# Altium schematic sheet DFSDM.SchDoc
size A4; DocumentNumber: 13; SheetNumber: 13; SheetTotal: 15
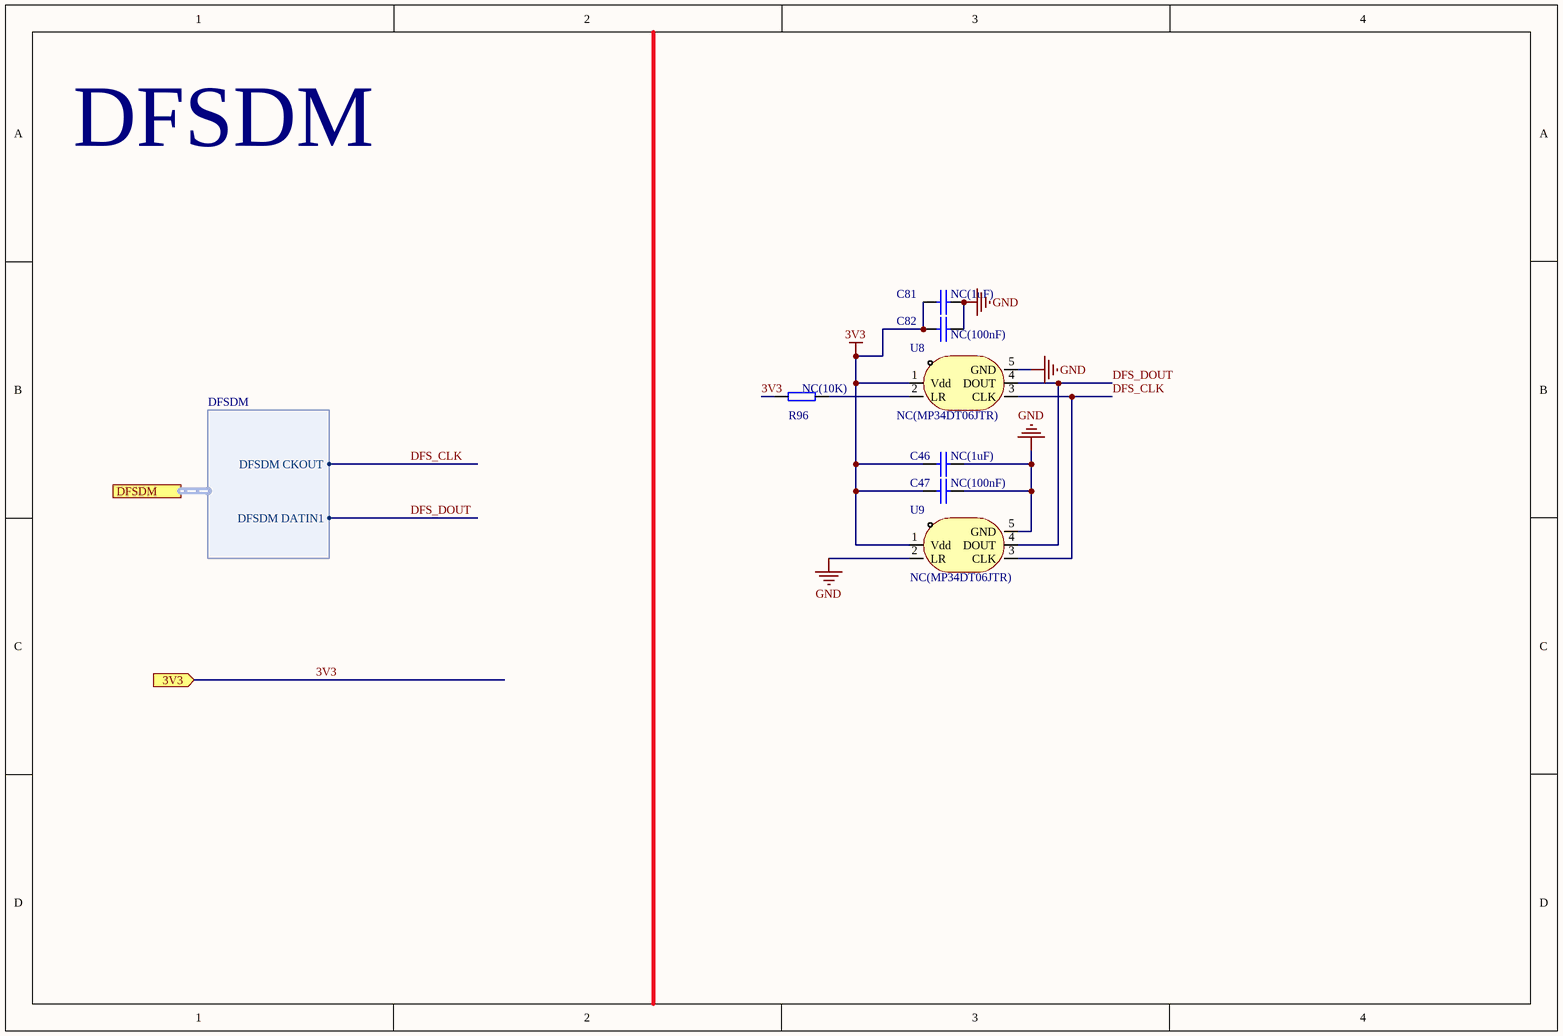
[diagram p0: DFSDM.SchDoc]

## Parts
C46  NC(1uF)  [0402_C]
C47  NC(100nF)  [0402_C]
C81  NC(1uF)  [0402_C]
C82  NC(100nF)  [0402_C]
R96  NC(10K)  [0402]
U8  NC(MP34DT06JTR)  [MIC-MP34DT06J-L3.0-W4.0-P0.85-1.35-BL]
U9  NC(MP34DT06JTR)  [MIC-MP34DT06J-L3.0-W4.0-P0.85-1.35-BL]

## Ports
3V3 (in), DFSDM (harness DFSDM)

## Harnesses
DFSDM: DFSDM CKOUT, DFSDM DATIN1

## Nets
3V3: C46.2 C47.2 C81.2 C82.2 R96.2 U8.1(Vdd) U9.1(Vdd) ; port 3V3
GND: C46.1 C47.1 C81.1 C82.1 U8.5(GND) U9.2(LR) U9.5(GND)
DFS_CLK: U8.3(CLK) U9.3(CLK) ; port DFSDM.DFSDM CKOUT
DFS_DOUT: U8.4(DOUT) U9.4(DOUT) ; port DFSDM.DFSDM DATIN1
NetR96_1: R96.1 U8.2(LR)

## Notes on the sheet
- DFSDM

## Library data of the parts
C46 C47 C81 C82 = CAP: Capacitor
R96 = RES
U8 U9 = MP34DT06JTR